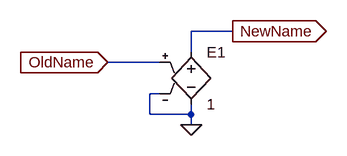
[diagram p0: schematic ChangeName.asc]
ChangeName.asc, the LTspice schematic file:
Version 4
SHEET 1 880 680
WIRE 368 16 304 16
WIRE 304 48 304 16
WIRE 256 64 176 64
WIRE 256 112 240 112
WIRE 240 144 240 112
WIRE 304 144 304 128
WIRE 304 144 240 144
WIRE 304 160 304 144
FLAG 176 64 OldName
IOPIN 176 64 In
FLAG 304 160 0
FLAG 368 16 NewName
IOPIN 368 16 Out
SYMBOL e 304 32 R0
SYMATTR InstName E1
SYMATTR Value 1

The netlist it stands for:
* ChangeName.asc
E1 NewName 0 OldName 0 1
.backanno
.end